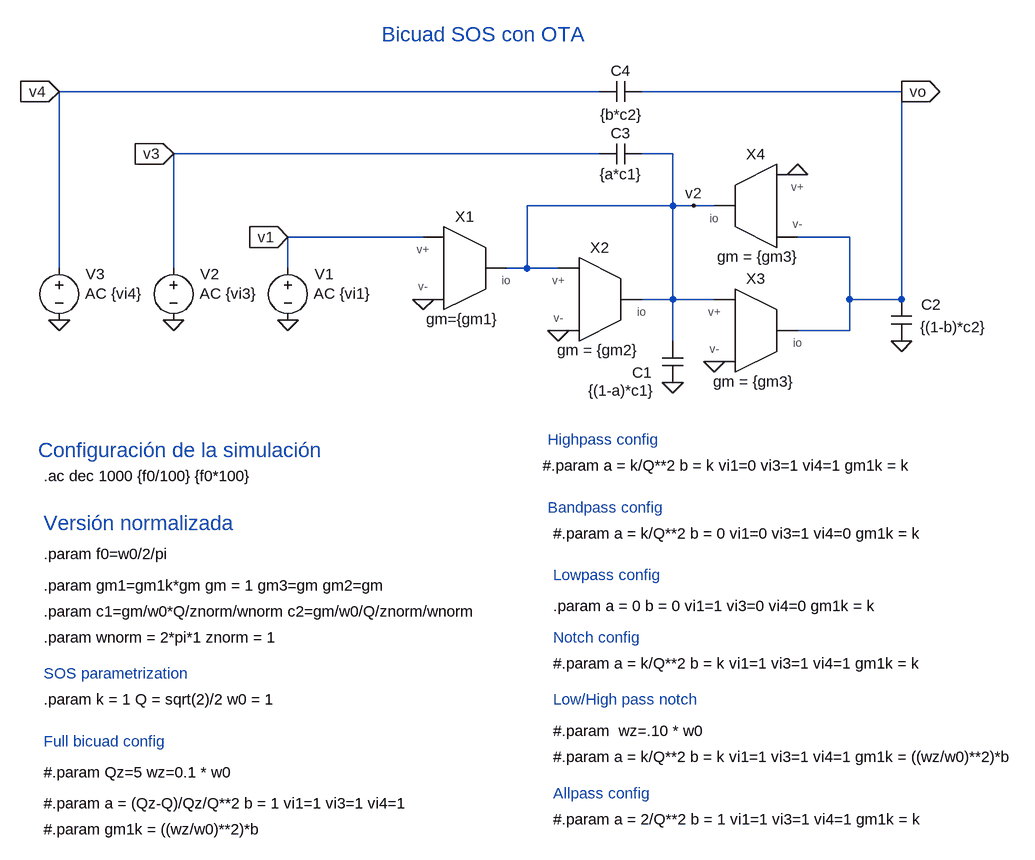
[diagram p0: schematic OTA bicuad.asc]
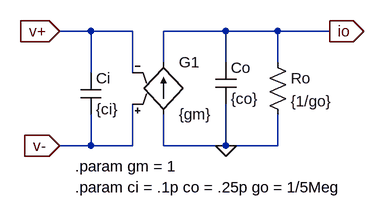
[diagram p1: sub-circuit ota.asc]
OTA bicuad.asc, the LTspice schematic file:
Version 4
SHEET 1 1728 1104
WIRE 240 -192 -592 -192
WIRE 704 -192 304 -192
WIRE 240 -96 -416 -96
WIRE 352 -96 304 -96
WIRE 352 -16 352 -96
WIRE 352 -16 128 -16
WIRE 384 -16 352 -16
WIRE 416 -16 384 -16
WIRE -32 32 -240 32
WIRE 624 32 544 32
WIRE -592 80 -592 -192
WIRE -416 80 -416 -96
WIRE -240 80 -240 32
WIRE 128 80 128 -16
WIRE 128 80 96 80
WIRE 176 80 128 80
WIRE 352 128 352 -16
WIRE 352 128 304 128
WIRE 416 128 352 128
WIRE 624 128 624 32
WIRE 704 128 704 -192
WIRE 704 128 624 128
WIRE 704 144 704 128
WIRE 624 176 624 128
WIRE 624 176 544 176
WIRE 352 192 352 128
FLAG -240 160 0
FLAG -240 32 v1
IOPIN -240 32 In
FLAG 416 224 0
FLAG 544 -64 0
FLAG 704 192 0
FLAG 704 -192 vo
IOPIN 704 -192 Out
FLAG -32 128 0
FLAG 176 176 0
FLAG 352 256 0
FLAG -416 -96 v3
IOPIN -416 -96 In
FLAG -592 -192 v4
IOPIN -592 -192 In
FLAG 384 -16 v2
FLAG -416 160 0
FLAG -592 160 0
SYMBOL voltage -240 64 R0
WINDOW 123 40 55 Left 2
WINDOW 39 0 0 Left 0
WINDOW 0 41 25 Left 2
SYMATTR Value2 AC {vi1}
SYMATTR InstName V1
SYMATTR Value ""
SYMBOL OTA 48 80 R0
WINDOW 39 -19 94 Bottom 2
SYMATTR SpiceLine gm={gm1}
SYMATTR InstName X1
SYMBOL OTA 256 128 R0
WINDOW 39 -19 94 Bottom 2
SYMATTR SpiceLine gm = {gm2}
SYMATTR InstName X2
SYMBOL cap 688 128 R0
WINDOW 0 46 8 Left 2
WINDOW 3 45 43 Left 2
SYMATTR InstName C2
SYMATTR Value {(1-b)*c2}
SYMBOL OTA 496 176 R0
WINDOW 39 -19 94 Bottom 2
SYMATTR SpiceLine gm = {gm3}
SYMATTR InstName X3
SYMBOL OTA 464 -16 M0
WINDOW 39 -19 94 Bottom 2
SYMATTR SpiceLine gm = {gm3}
SYMATTR InstName X4
SYMBOL cap 336 192 R0
WINDOW 0 -46 49 Left 2
WINDOW 3 -114 76 Left 2
SYMATTR InstName C1
SYMATTR Value {(1-a)*c1}
SYMBOL cap 304 -112 R90
WINDOW 0 0 32 VBottom 2
WINDOW 3 32 32 VTop 2
SYMATTR InstName C3
SYMATTR Value {a*c1}
SYMBOL cap 304 -208 R90
WINDOW 0 0 32 VBottom 2
WINDOW 3 36 31 VTop 2
SYMATTR InstName C4
SYMATTR Value {b*c2}
SYMBOL voltage -416 64 R0
WINDOW 123 40 55 Left 2
WINDOW 39 0 0 Left 0
WINDOW 0 41 25 Left 2
SYMATTR Value2 AC {vi3}
SYMATTR InstName V2
SYMATTR Value ""
SYMBOL voltage -592 64 R0
WINDOW 123 40 55 Left 2
WINDOW 39 0 0 Left 0
WINDOW 0 41 25 Left 2
SYMATTR Value2 AC {vi4}
SYMATTR InstName V3
SYMATTR Value ""
TEXT -616 400 Left 2 !.ac dec 1000 {f0/100} {f0*100}
TEXT -616 744 Left 2 !.param k = 1 Q = sqrt(2)/2 w0 = 1
TEXT -624 360 Left 3 ;Configuración de la simulación
TEXT -616 472 Left 3 ;Versión normalizada
TEXT -616 520 Left 2 !.param f0=w0/2/pi
TEXT -96 -280 Left 3 ;Bicuad SOS con OTA
TEXT -616 568 Left 2 !.param gm1=gm1k*gm gm = 1 gm3=gm gm2=gm
TEXT -616 648 Left 2 !.param wnorm = 2*pi*1 znorm = 1
TEXT -616 856 Left 2 !#.param Qz=5 wz=0.1 * w0
TEXT -616 808 Left 2 ;Full bicuad config
TEXT 168 744 Left 2 ;Low/High pass notch
TEXT 168 792 Left 2 !#.param  wz=.10 * w0
TEXT 160 344 Left 2 ;Highpass config
TEXT 168 888 Left 2 ;Allpass config
TEXT 168 552 Left 2 ;Lowpass config
TEXT 168 600 Left 2 !.param a = 0 b = 0 vi1=1 vi3=0 vi4=0 gm1k = k
TEXT 160 448 Left 2 ;Bandpass config
TEXT -616 704 Left 2 ;SOS parametrization
TEXT 168 648 Left 2 ;Notch config
TEXT 168 488 Left 2 !#.param a = k/Q**2 b = 0 vi1=0 vi3=1 vi4=0 gm1k = k
TEXT 152 384 Left 2 !#.param a = k/Q**2 b = k vi1=0 vi3=1 vi4=1 gm1k = k
TEXT 168 688 Left 2 !#.param a = k/Q**2 b = k vi1=1 vi3=1 vi4=1 gm1k = k
TEXT 168 928 Left 2 !#.param a = 2/Q**2 b = 1 vi1=1 vi3=1 vi4=1 gm1k = k
TEXT 168 832 Left 2 !#.param a = k/Q**2 b = k vi1=1 vi3=1 vi4=1 gm1k = ((wz/w0)**2)*b
TEXT -616 904 Left 2 !#.param a = (Qz-Q)/Qz/Q**2 b = 1 vi1=1 vi3=1 vi4=1
TEXT -616 608 Left 2 !.param c1=gm/w0*Q/znorm/wnorm c2=gm/w0/Q/znorm/wnorm
TEXT -616 944 Left 2 !#.param gm1k = ((wz/w0)**2)*b

ota.asc, the sub-circuit schematic file:
Version 4
SHEET 1 880 680
WIRE -16 80 -64 80
WIRE 48 80 -16 80
WIRE 192 80 96 80
WIRE 272 80 192 80
WIRE 352 80 272 80
WIRE 96 128 96 80
WIRE 192 128 192 80
WIRE 272 128 272 80
WIRE -16 144 -16 80
WIRE 48 144 48 80
WIRE -16 256 -16 208
WIRE -16 256 -64 256
WIRE 48 256 48 192
WIRE 48 256 -16 256
WIRE 96 256 96 208
WIRE 192 256 192 192
WIRE 192 256 96 256
WIRE 272 256 272 208
WIRE 272 256 192 256
FLAG 352 80 io
IOPIN 352 80 Out
FLAG -64 80 v+
IOPIN -64 80 In
FLAG -64 256 v-
IOPIN -64 256 In
FLAG 192 256 0
SYMBOL cap -32 144 R0
SYMATTR InstName Ci
SYMATTR Value {ci}
SYMATTR SpiceLine Rser=0
SYMBOL cap 176 128 R0
SYMATTR InstName Co
SYMATTR Value {co}
SYMATTR SpiceLine Rser=0
SYMBOL res 256 112 R0
SYMATTR InstName Ro
SYMATTR Value {1/go}
SYMBOL g2 96 112 R0
SYMATTR InstName G1
SYMATTR Value {gm}
TEXT -40 288 Left 2 !.param gm = 1
TEXT -40 320 Left 2 !.param ci = .1p co = .25p go = 1/5Meg

The netlist it stands for:
* OTA bicuad.asc
V1 v1 0 AC {vi1}
XX1 v2 v1 0 ota params: gm={gm1}
XX2 v2 v2 0 ota params: gm = {gm2}
C2 vo 0 {(1-b)*c2}
XX3 vo v2 0 ota params: gm = {gm3}
XX4 v2 0 vo ota params: gm = {gm3}
C1 v2 0 {(1-a)*c1}
C3 v2 v3 {a*c1}
C4 vo v4 {b*c2}
V2 v3 0 AC {vi3}
V3 v4 0 AC {vi4}

* block symbol definitions
.subckt ota io v+ v-
Ci v+ v- {ci} Rser=0
Co io 0 {co} Rser=0
Ro io 0 {1/go}
G1 0 io v- v+ {gm}
.param gm = 1
.param ci = .1p co = .25p go = 1/5Meg
.ends ota

.ac dec 1000 {f0/100} {f0*100}
.param k = 1 Q = sqrt(2)/2 w0 = 1
* Configuración de la simulación
* Versión normalizada
.param f0=w0/2/pi
* Bicuad SOS con OTA
.param gm1=gm1k*gm gm = 1 gm3=gm gm2=gm
.param wnorm = 2*pi*1 znorm = 1
#.param Qz=5 wz=0.1 * w0
* Full bicuad config
* Low/High pass notch
#.param  wz=.10 * w0
* Highpass config
* Allpass config
* Lowpass config
.param a = 0 b = 0 vi1=1 vi3=0 vi4=0 gm1k = k
* Bandpass config
* SOS parametrization
* Notch config
#.param a = k/Q**2 b = 0 vi1=0 vi3=1 vi4=0 gm1k = k
#.param a = k/Q**2 b = k vi1=0 vi3=1 vi4=1 gm1k = k
#.param a = k/Q**2 b = k vi1=1 vi3=1 vi4=1 gm1k = k
#.param a = 2/Q**2 b = 1 vi1=1 vi3=1 vi4=1 gm1k = k
#.param a = k/Q**2 b = k vi1=1 vi3=1 vi4=1 gm1k = ((wz/w0)**2)*b
#.param a = (Qz-Q)/Qz/Q**2 b = 1 vi1=1 vi3=1 vi4=1
.param c1=gm/w0*Q/znorm/wnorm c2=gm/w0/Q/znorm/wnorm
#.param gm1k = ((wz/w0)**2)*b
.backanno
.end